# EAGLE design Adafruit Feather M0 Adalogger (EAGLE 9.6.2)
COMPANY: ADAFRUIT INDUSTRIES; DRAWN: KTOWN; REV: B
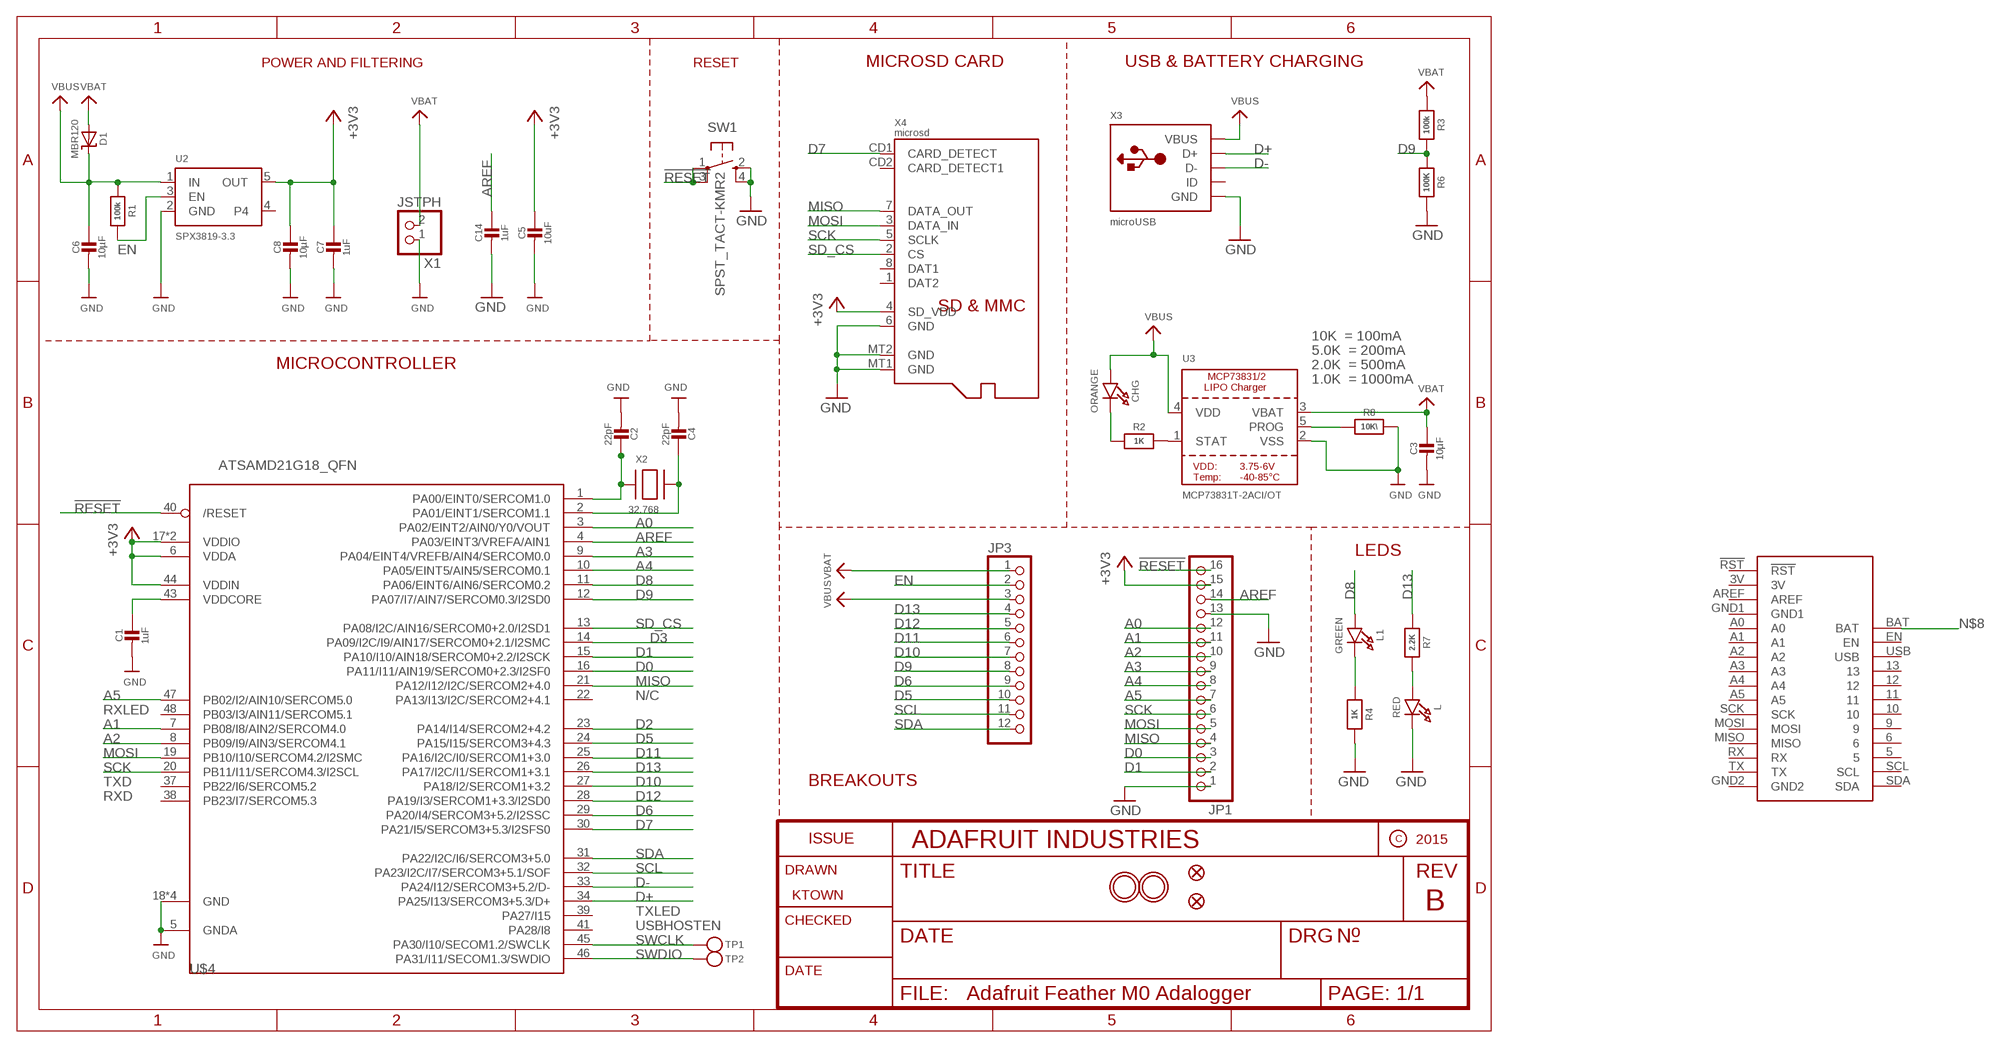
[diagram p0: schematic, sheet 1]

## Parts
C1  1uF  CAP_CERAMIC0603_NO  [0603-NO]
C2  22pF  CAP_CERAMIC0603_NO  [0603-NO]
C3  10µF  CAP_CERAMIC0805-NOOUTLINE  [0805-NO]
C4  22pF  CAP_CERAMIC0603_NO  [0603-NO]
C5  10uF  CAP_CERAMIC0805-NOOUTLINE  [0805-NO]
C6  10µF  CAP_CERAMIC0805-NOOUTLINE  [0805-NO]
C7  1uF  CAP_CERAMIC0603_NO  [0603-NO]
C8  10µF  CAP_CERAMIC0805-NOOUTLINE  [0805-NO]
C14  1uF  CAP_CERAMIC0603_NO  [0603-NO]
CHG  ORANGE  LED0805_NOOUTLINE  [CHIPLED_0805_NOOUTLINE]
D1  MBR120  DIODE-SCHOTTKYSOD-123  [SOD-123]
JP1  HEADER-1X16ROUND  [1X16_ROUND]
JP3  HEADER-1X12  [1X12_ROUND]
L  RED  LED0805_NOOUTLINE  [CHIPLED_0805_NOOUTLINE]
L1  GREEN  LED0805_NOOUTLINE  [CHIPLED_0805_NOOUTLINE]
R1  100k  RESISTOR_0603_NOOUT  [0603-NO]
R2  1K  RESISTOR_0603_NOOUT  [0603-NO]
R3  100k  RESISTOR_0603_NOOUT  [0603-NO]
R4  1K  RESISTOR_0603_NOOUT  [0603-NO]
R6  100K  RESISTOR_0603_NOOUT  [0603-NO]
R7  2.2K  RESISTOR_0603_NOOUT  [0603-NO]
R8  10K\  RESISTOR_0603_NOOUT  [0603-NO]
SW1  SPST_TACT-KMR2  [KMR2]
TP1  TESTPOINTROUND1.5MM  [TESTPOINT_ROUND_1.5MM]
TP2  TESTPOINTROUND1.5MM  [TESTPOINT_ROUND_1.5MM]
U2  SPX3819-3.3  VREG_SOT23-5  [SOT23-5]
U3  MCP73831T-2ACI/OT  MCP73831/2  [SOT23-5]
U$4  ATSAMD21G18_QFN  ATSAMD21J_QFN  [TQFN48_7MM]
U$12  FEATHER_MO_ADALOGGER  [FEATHER_M0_ADALOGGER]
U$31  MOUNTINGHOLE2.5  [MOUNTINGHOLE_2.5_PLATED]
U$32  MOUNTINGHOLE2.5  [MOUNTINGHOLE_2.5_PLATED]
U$34  FIDUCIAL""  [FIDUCIAL_1MM]
U$35  FIDUCIAL""  [FIDUCIAL_1MM]
X1  JSTPH  CON_JST_PH_2PIN  [JSTPH2]
X2  32.768  XTAL-3.2X1.5  [XTAL3215]
X3  microUSB  USB_MICRO_20329_V2  [4UCONN_20329_V2]
X4  microsd  MICROSD  [MICROSD]

## Nets
!RESET: JP1.16 SW1.1(P) SW1.3(P1) U$4.40(/RESET)
+3V3: C5.1 C7.1 C8.1 JP1.15 U2.5(OUT) U$4.6(VDDA) U$4.17(VDDIO) U$4.36(VDDIO) U$4.44(VDDIN) X4.4(SD_VDD)
A0: JP1.12 U$4.3(PA02/EINT2/AIN0/Y0/VOUT)
A1: JP1.11 U$4.7(PB08/I8/AIN2/SERCOM4.0)
A2: JP1.10 U$4.8(PB09/I9/AIN3/SERCOM4.1)
A3: JP1.9 U$4.9(PA04/EINT4/VREFB/AIN4/SERCOM0.0)
A4: JP1.8 U$4.10(PA05/EINT5/AIN5/SERCOM0.1)
A5: JP1.7 U$4.47(PB02/I2/AIN10/SERCOM5.0)
AREF: C14.1 JP1.14 U$4.4(PA03/EINT3/VREFA/AIN1)
D0: JP1.3 U$4.16(PA11/I11/AIN19/SERCOM0+2.3/I2SF0)
D1: JP1.2 U$4.15(PA10/I10/AIN18/SERCOM0+2.2/I2SCK)
D2: U$4.23(PA14/I14/SERCOM2+4.2)
D3: U$4.14(PA09/I2C/I9/AIN17/SERCOM0+2.1/I2SMC)
D5: JP3.10 U$4.24(PA15/I15/SERCOM3+4.3)
D6: JP3.9 U$4.29(PA20/I4/SERCOM3+5.2/I2SSC)
D7: U$4.30(PA21/I5/SERCOM3+5.3/I2SFS0) X4.CD1(CARD_DETECT)
D8: L1.A U$4.11(PA06/EINT6/AIN6/SERCOM0.2)
D9: JP3.8 R3.2 R6.1 U$4.12(PA07/I7/AIN7/SERCOM0.3/I2SD0)
D10: JP3.7 U$4.27(PA18/I2/SERCOM1+3.2)
D11: JP3.6 U$4.25(PA16/I2C/I0/SERCOM1+3.0)
D12: JP3.5 U$4.28(PA19/I3/SERCOM1+3.3/I2SD0)
D13: JP3.4 R7.1 U$4.26(PA17/I2C/I1/SERCOM1+3.1)
D+: U$4.34(PA25/I13/SERCOM3+5.3/D+) X3.D+
D-: U$4.33(PA24/I12/SERCOM3+5.2/D-) X3.D-
EN: JP3.2 R1.2 U2.3(EN)
GND: C1.2 C2.2 C3.2 C4.2 C5.2 C6.2 C7.2 C8.2 C14.2 JP1.1 JP1.13 L.C R4.2 R6.2 R8.2 SW1.2(S) SW1.4(S1) U2.2(GND) U3.2(VSS) U$4.5(GNDA) U$4.18(GND) U$4.35(GND) U$4.42(GND) U$4.THERMAL(GND) X1.1 X3.BASE@1(GND) X3.BASE@2(GND) X3.GND X3.SPRT@1(GND) X3.SPRT@2(GND) X3.SPRT@3(GND) X3.SPRT@4(GND) X4.6(GND) X4.MT1(GND) X4.MT2(GND)
MISO: JP1.4 U$4.21(PA12/I12/I2C/SERCOM2+4.0) X4.7(DATA_OUT)
MOSI: JP1.5 U$4.19(PB10/I10/SERCOM4.2/I2SMC) X4.3(DATA_IN)
N$1: CHG.C R2.1
N$2: L.A R7.2
N$3: R2.2 U3.1(STAT)
N$4: R8.1 U3.5(PROG)
N$5: C2.1 U$4.1(PA00/EINT0/SERCOM1.0) X2.P$1
N$6: L1.C R4.1
N$7: C4.1 U$4.2(PA01/EINT1/SERCOM1.1) X2.P$2
N$8: U$12.BAT
SCK: JP1.6 U$4.20(PB11/I11/SERCOM4.3/I2SCL) X4.5(SCLK)
SCL: JP3.11 U$4.32(PA23/I2C/I7/SERCOM3+5.1/SOF)
SD_CS: U$4.13(PA08/I2C/AIN16/SERCOM0+2.0/I2SD1) X4.2(CS)
SDA: JP3.12 U$4.31(PA22/I2C/I6/SERCOM3+5.0)
SWCLK: TP1.P$1 U$4.45(PA30/I10/SECOM1.2/SWCLK)
SWDIO: TP2.P$1 U$4.46(PA31/I11/SECOM1.3/SWDIO)
VBAT: C3.1 D1.A JP3.1 R3.1 U3.3(VBAT) X1.2
VBUS: C6.1 CHG.A D1.C JP3.3 R1.1 U2.1(IN) U3.4(VDD) X3.VBUS
VDDCORE: C1.1 U$4.43(VDDCORE)
Unconnected: U2.4 U$4.22(PA13/I13/I2C/SERCOM2+4.1) U$4.37(PB22/I6/SERCOM5.2) U$4.38(PB23/I7/SERCOM5.3) U$4.39(PA27/I15) U$4.41(PA28/I8) U$4.48(PB03/I3/AIN11/SERCOM5.1) U$12.3V U$12.5 U$12.6 U$12.9 U$12.10 U$12.11 U$12.12 U$12.13 U$12.!RST U$12.A0 U$12.A1 U$12.A2 U$12.A3 U$12.A4 U$12.A5 U$12.AREF U$12.EN U$12.GND1 U$12.GND2 U$12.MISO U$12.MOSI U$12.RX U$12.SCK U$12.SCL U$12.SDA U$12.TX U$12.USB X3.ID X4.1(DAT2) X4.8(DAT1) X4.CD2(CARD_DETECT1)

## Notes on the sheet
- POWER AND FILTERING | RESET | MICROSD CARD | USB & BATTERY CHARGING
- 10K  = 100mA
- 5.0K  = 200mA
- MICROCONTROLLER | 2.0K  = 500mA
- 1.0K  = 1000mA
- LEDS
- N/C
- RXLED
- TXD | BREAKOUTS
- RXD
- TXLED
- USBHOSTEN

## Library data of the parts
C1-C8 C14 = microbuilder:CAP_CERAMIC: Ceramic Capacitors For new designs, use the packages preceded by an '_' character since they are more reliable: The following footprints should be used on most boards: _0402 - Standard footprint for regular board layouts _0603 - Standard footprint for regular board layouts _0805 - Standard footprint for regular board layouts _1206 - Standard footprint for regular board layouts For extremely tight-pitch boards where space is at a premium, the following 'micro-pitch' footprints can be used (smaller pads, no silkscreen outline, etc.): _0402MP - Micro-pitch footprint for very dense/compact boards _0603MP - Micro-pitch footprint for very dense/compact boards _0805MP - Micro-pitch footprint for very dense/compact boards _1206MP - Micro-pitch footprint for very dense/compact boards
CHG L L1 = microbuilder:LED: LED 0603 - 0603 Surface Mount Package 2mA: Green LED - Low Power (3.9mcd, 2ma, 1.7Vf) - Digikey: 475-2709-2-ND Orange LED - Low Power (9.8mcd, 2ma, 1.8Vf) - Digikey: 475-1194-2-ND Red LED - Low Power (5mcd, 2ma, 1.8Vf) - Digikey: 475-1195-2-ND Yellow LED - Low Power (7mcd, 2ma, 1.8Vf) - Digikey: 475-1196-2-ND 5mA: Blue LED - Low Power (17mcd, 5ma, 2.9Vf) - Digikey: LNJ937W8CRACT-ND 0805 - 0805 Surface Mount Package 2mA: Red LED (8.8mcd, 2mA, 1.8Vf, Clear) - Low Power [Digikey: 475-2510-1-ND] Green LED (5mcd, 2mA, 1.8Vf, Clear) - Low Power [Digikey: 475-2730-1-ND] Yellow LED (11.3mcd, 2mA, 1.8Vf, Clear) - Low Power [Digikey: 475-2555-1-ND] 20mA: Red LED (104mcd, 20mA, Diffused) - LS R976 [Digikey: 475-1278-6-ND] Red LED (12mcd, 20mA, 2.0Vf, Clear) - APT2012EC [Digikey: 754-1128-1-ND] Green LED (15mcd, 20mA, 2.2Vf, Clear) - APT2012GC [Digikey: 754-1131-1-ND] Orange LED (160mcd, 20mA, 2.1Vf, Clear) - APT2012SECK [Digikey: 754-1130-1-ND] 1206 - 1206 Surface Mount Package Green LED (26mcd, 20mA, Diffused) - LG N971 [Digikey: 475-1407-6-ND] Red LED (15mcd, 20mA, Diffused) - LH N974 [Digikey: 475-1416-6-ND] Cree - Cree High-Power Surface Mount LEDs XPEBWT-L1-0000-00D50 - White 111lm 350mA 2.9Vf 6200K 110° XTEAWT-00-0000-00000LEE3 - White 114lm 350mA 2.85Vf 5000K 115° Everlight - Everlight 45-21 Series Surface Mount LEDs 45-21/QK2C-B2832AC2CB2/2T - Warm White 2000mcd 20mA 3.25Vf 3050K 120° 45-21/LK2C-B38452C4CB2/2T - Nuetral White 2000mcd 20mA 3.25Vf 4150K 120° 45-21/LK2C-B50634C6CB2/2T - Cold White 2200mcd 20mA 3.25Vf 5650K 120° PLCC2 Reverse Mount LS T77K-J1L2-1-0-2-R18-Z - Red 11.25mcd 2mA 1.8Vf 630nm 120° LO T77K-L1M2-24-Z - Orange 19.6mcd 2mA 1.8Vf 606nm 120° LY T77K-K2M1-26-Z - Yellow 15.7mcd 2mA 1.8Vf 587nm 120°
D1 = microbuilder:DIODE-SCHOTTKY
JP1 = microbuilder:HEADER-1X16: PIN HEADER
JP3 = microbuilder:HEADER-1X12
R1-R4 R6-R8 = microbuilder:RESISTOR: Resistors For new designs, use the packages preceded by an '_' character since they are more reliable: The following footprints should be used on most boards: _0402 - Standard footprint for regular board layouts _0603 - Standard footprint for regular board layouts _0805 - Standard footprint for regular board layouts _1206 - Standard footprint for regular board layouts For extremely tight-pitch boards where space is at a premium, the following 'micro-pitch' footprints can be used (smaller pads, no silkscreen outline, etc.): _0402MP - Micro-pitch footprint for very dense/compact boards _0603MP - Micro-pitch footprint for very dense/compact boards _0805MP - Micro-pitch footprint for very dense/compact boards _1206MP - Micro-pitch footprint for very dense/compact boards
SW1 = adafruit:SPST_TACT: SMT 6mm switch, EVQQ2 series http://www.ladyada.net/library/eagle
TP1 TP2 = microbuilder:TESTPOINT: Test Point Various test points for characterisation and PCB testing TESTPOINT_SMT - Compact Surface Mount Test Point [Digikey: 5016KTR-ND]
U2 = microbuilder:VREG_SOT23-5: SOT23-5 Fixed Voltage Regulators Part Current Out V Out V In V Dropout θJA (°C/W) TJ (°C) Digikey Part No. ADP121 150mA 3.3V 3.4-5.5V 0.09V @ 150mA -- -- ADP121-AUJZ33R7CT-ND ADP121 150mA 3.0V 3.1-5.5V 0.09V @ 150mA -- -- ADP121-AUJZ30R7CT-ND ADP122 300mA 3.3V 3.4-5.5V 0.085V @ 300mA -- -- ADP122AUJZ-3.3-R7CT-ND ADP1712 300mA 3.3V 3.5-5.5V 0.17V @ 300mA -- -- ADP1712AUJZ-3.3-R7TR-ND AP7311 (Low Cost) 150mA 3.3V 3.5-6V 0.15V @ 150mA -- -- AP7311-33WG-7DICT-ND LD39015M18R 150mA 1.8V 1.9V-5.5V 0.08V @ 100mA -- -- 497-6977-1-ND LP2985A-33DBVR 150mA 3.3V 3.3-16V 0.28V @ 150mA 206 150 296-18479-1-ND MCP1824T-3302E/OT 300mA 3.3V 3.5V-6V 0.2V @ 300mA -- -- MCP1824T-3302E/OTCT-ND MIC5205-2.5YM5 TR 150mA 2.5V 2.7-16V 0.165V @ 150mA -- -- 576-1257-2-ND MIC5205-3.0YM5 TR 150mA 3.0V 3.2V-16V 0.165V @ 150mA -- -- 576-1258-2-ND MIC5205-3.3YM5 TR 150mA 3.3V 3.5V-16V 0.165V @ 150mA -- -- 576-1259-2-ND TPS780330220 150mA 3.3V+2.2V 3.6-5.5V 250mV Max -- -- 296-23332-1-ND TDA3663/N1,135 100mA 3.3V 3.5-45V 0.18V @ 50mA -- -- 568-5343-1-ND Max operating temp can be calculated using θJA, TJ (max junction temperature), and power in watts. Set the "Maximum Ambient Temperature" until it reaches TJ ("Max Junction Temperature"), which is the absolute limit for safe use of the regulator: Heat Sink Temperature Calculator <http://www.daycounter.com/Calculators/Heat-Sink-Temperature-Calculator.phtml> For example, With 12V source into a 3.3V LP2985 and a 30mA load, we are dissipating (12V-3.3V) * 0.03A = 0.261W. With a θJA of 206 °C/W, a TJ of 150°C, and 261mW we can safely use the chip without a heat sink up to 75°C (=147.1°C Junction Temperature).
U3 = microbuilder:MCP73831/2: MCP73831/2 LIPO Charger VDD: 3.75 - 6V Temp -40 - 85°C Programmable Charge Rate: 15-500mA NOTE: STAT is a tri-state logic output on the MCP73831 and an open-drain output on the MCP73832. SOT23-5 with 4.2V output and tri-state logic on STAT = MCP73831T-2ACI/OT
U$4 = microbuilder:ATSAMD21J
U$12 = GNSS-proto:FEATHER_MO_ADALOGGER
U$31 U$32 = microbuilder:MOUNTINGHOLE: Mounting Hole For #2 screws (0.086"/2.18mm width, 0.094"/2.4mm hole) use 2.5mm; BOM: EXCLUDE
U$34 U$35 = microbuilder:FIDUCIAL: Fiducial Alignment Points Various fiducial points for machine vision alignment.; BOM: EXCLUDE
X1 = microbuilder:CON_JST_PH_2PIN: JST 2-Pin Right-Angle Connector PH-Series - 4UConnector: 17311 SH-Series - 4UConnector: 07278
X2 = adafruit2:XTAL: Low cost SMT crystals, no capacitors included http://www.ladyada.net/library/eagle
X3 = microbuilder:USB: USB Connectors USBMINIB - Surface Mount Female Mini-B USB Connector 4UConnector: 06564
X4 = microbuilder:MICROSD: MicroSD/Transflash Card Holder with SPI pinout 3M: 2908-05WB-MG 4UConnector: 19656 Footprint courtesy: Adafruit Industries

## Board
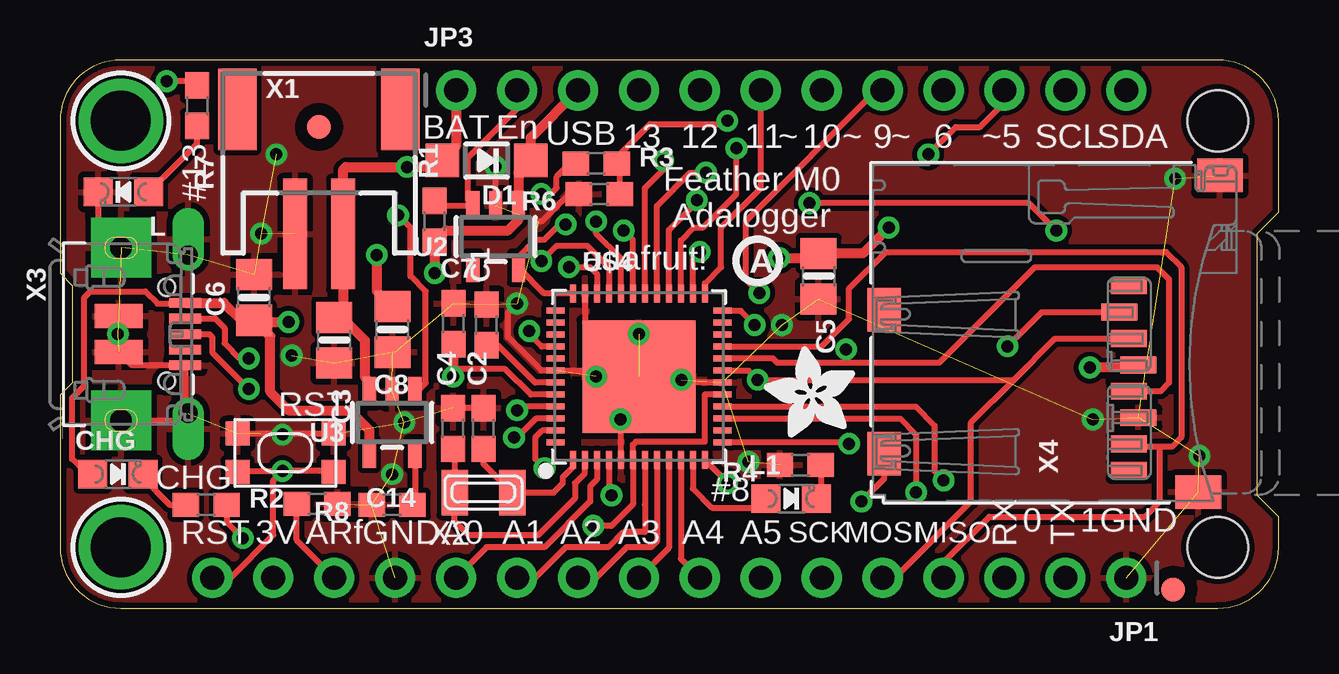
[diagram p1: board, top side]
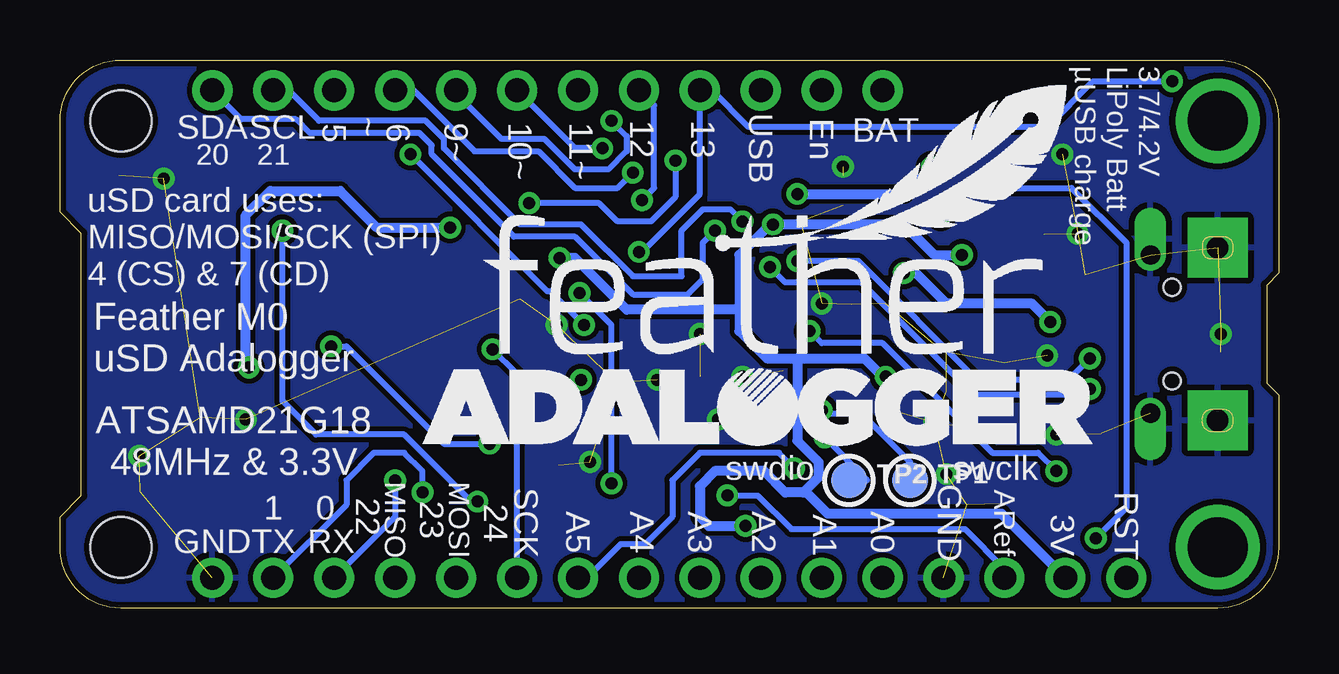
[diagram p2: board, bottom side, seen from below]

Size 50.8 x 22.86 mm. Coordinates in mm from the lower left corner, seen from the top.
Outline: 2.54,0 48.26,0 arc90 50.8,2.54 50.8,3.81 49.91,4.7 49.91,15.62 50.8,16.51 50.8,20.32 arc90 48.26,22.86 2.54,22.86 arc90 0,20.32 0,13.97 0.51,13.46 0.51,9.4 0,8.89 0,2.54 arc90 2.54,0
Copper layers (1*16): Top 0.035mm / dielectric 1.5mm / Bottom 0.035mm
Design rules "adafruit *": minimum track width 8mil, minimum drill 15.5mil, track to track 8mil, track to pad 8mil, pad to pad 8mil, via to via 8mil, smd to smd 8mil, copper to edge 10mil, drill to drill 8mil, minimum pad ring 10mil, minimum via ring 8mil, stop-mask expansion 2mil, vias tented up to drill 20mil, thermal gap 10mil
Holes 2.54 mm at 48.26,20.32 48.26,2.54
tRestrict: area 21.3,6.9 to 21.7,9.7; area 22.1,12.1 to 27.1,12.4; area 26.5,9.7 to 27.1,12.2

### Footprints (pad centres in the part's own frame; a part is rotated, then mirrored left to right if it is on the bottom)
0603-NO = smd 1.1 x 1: 1 -0.85,0; 2 0.85,0
0805-NO = smd 1.3 x 1.5: 1 -0.95,0; 2 0.95,0
CHIPLED_0805_NOOUTLINE = smd 1.2 x 1.2: A 0,-1.05; C 0,1.05
SOD-123 = smd 1.4 x 1.4: A 1.85,0; C -1.85,0
1X16_ROUND = drill 1 pad 1.676: 1 -19.05,0; 2 -16.51,0; 3 -13.97,0; 4 -11.43,0; 5 -8.89,0; 6 -6.35,0; 7 -3.81,0; 8 -1.27,0; 9 1.27,0; 10 3.81,0; 11 6.35,0; 12 8.89,0; 13 11.43,0; 14 13.97,0; 15 16.51,0; 16 19.05,0
1X12_ROUND = drill 1 pad 1.676: 1 -13.97,0; 2 -11.43,0; 3 -8.89,0; 4 -6.35,0; 5 -3.81,0; 6 -1.27,0; 7 1.27,0; 8 3.81,0; 9 6.35,0; 10 8.89,0; 11 11.43,0; 12 13.97,0
KMR2 = smd 1 x 1: 1 2,0.8; 2 2,-0.8; 3 -2,0.8; 4 -2,-0.8
TESTPOINT_ROUND_1.5MM = smd 1.5 x 1.5: P$1 0,0
SOT23-5 = smd 0.55 x 1.2: 1 -0.95,-1.3; 2 0,-1.3; 3 0.95,-1.3; 4 0.95,1.3; 5 -0.95,1.3
TQFN48_7MM = smd 0.25 x 0.75: 1 -2.75,-3.475; 2 -2.25,-3.475; 3 -1.75,-3.475; 4 -1.25,-3.475; 5 -0.75,-3.475; 6 -0.25,-3.475; 7 0.25,-3.475; 8 0.75,-3.475; 9 1.25,-3.475; 10 1.75,-3.475; 11 2.25,-3.475; 12 2.75,-3.475; 25 2.75,3.475; 26 2.25,3.475; 27 1.75,3.475; 28 1.25,3.475; 29 0.75,3.475; 30 0.25,3.475; 31 -0.25,3.475; 32 -0.75,3.475; 33 -1.25,3.475; 34 -1.75,3.475; 35 -2.25,3.475; 36 -2.75,3.475 | smd 0.75 x 0.25: 13 3.475,-2.75; 14 3.475,-2.25; 15 3.475,-1.75; 16 3.475,-1.25; 17 3.475,-0.75; 18 3.475,-0.25; 19 3.475,0.25; 20 3.475,0.75; 21 3.475,1.25; 22 3.475,1.75; 23 3.475,2.25; 24 3.475,2.75; 37 -3.475,2.75; 38 -3.475,2.25; 39 -3.475,1.75; 40 -3.475,1.25; 41 -3.475,0.75; 42 -3.475,0.25; 43 -3.475,-0.25; 44 -3.475,-0.75; 45 -3.475,-1.25; 46 -3.475,-1.75; 47 -3.475,-2.25; 48 -3.475,-2.75 | smd 4.7 x 4.7: THERMAL 0,0
FEATHER_M0_ADALOGGER = drill 1 pad 1.676: 3V 8.89,1.27; 5 39.37,21.59; 6 36.83,21.59; 9 34.29,21.59; 10 31.75,21.59; 11 29.21,21.59; 12 26.67,21.59; 13 24.13,21.59; !RST 6.35,1.27; A0 16.51,1.27; A1 19.05,1.27; A2 21.59,1.27; A3 24.13,1.27; A4 26.67,1.27; A5 29.21,1.27; AREF 11.43,1.27; BAT 16.51,21.59; EN 19.05,21.59; GND1 13.97,1.27; GND2 44.45,1.27; MISO 36.83,1.27; MOSI 34.29,1.27; RX 39.37,1.27; SCK 31.75,1.27; SCL 41.91,21.59; SDA 44.45,21.59; TX 41.91,1.27; USB 21.59,21.59 | hole 2.54: 48.26,20.32; 48.26,2.54; 2.54,20.32; 2.54,2.54
MOUNTINGHOLE_2.5_PLATED = drill 2.5 pad 3.2: P$1 0,0
FIDUCIAL_1MM = smd 1 x 1: 1 0,0
JSTPH2 = smd 1 x 4.6: 1 -1,-3.7; 2 1,-3.7 | smd 1.6 x 3.4: NC1 -3.4,1.5; NC2 3.4,1.5
XTAL3215 = smd 1.1 x 1.9: P$1 1.2,0; P$2 -1.2,0
4UCONN_20329_V2 = smd 1 x 2: BASE@1 -0.75,-2; BASE@2 0.75,-2 | smd 0.4 x 1.35: D+ 0,0.775; D- -0.65,0.775; GND 1.3,0.775; ID 0.65,0.775; VBUS -1.3,0.775 | drill 0.8 pad 1.2 offset: SPRT@1 -3.3,0.9; SPRT@2 3.3,0.9 | drill 0.9 pad 2.5 square: SPRT@3 -3.6,-1.9; SPRT@4 3.6,-1.9 | hole 0.7: -1.95,0; 1.95,0
MICROSD = smd 0.7 x 1.5: 1 9,-10.64; 2 7.9,-10.24; 3 6.8,-10.64; 4 5.7,-11.04; 5 4.6,-10.64; 6 3.5,-11.04; 7 2.4,-10.64; 8 1.3,-10.64 | smd 1.8 x 1.4: CD1 2,-0.44; CD2 8,-0.44 | smd 1.4 x 1.9: MT1 0.4,-13.54; MT2 13.6,-14.44

### Placement (x,y rotation side)
C1  17.78,11.81 90 top
C2  17.65,7.49 90 top
C3  11.43,11.18 270 top
C4  16.38,7.49 90 top
C5  31.62,13.84 270 top
C6  8.09,12.96 90 top
C7  16.4,11.86 90 top
C8  13.86,11.62 270 top
C14  10.72,4.34 0 top
CHG  2.41,5.59 270 top
D1  17.78,18.67 180 top
JP1  25.4,1.27 180 top
JP3  30.48,21.59 0 top
L  2.65,17.36 90 top
L1  30.48,4.57 270 top
R1  15.62,16.13 90 top
R2  6.1,4.32 0 top
R3  22.35,18.54 0 top
R4  30.86,5.97 180 top
R6  22.48,17.27 180 top
R7  5.71,20.95 270 top
R8  13.84,4.32 180 top
SW1  9.4,6.48 180 top
TP1  15.37,5.33 0 bottom
TP2  17.91,5.33 0 bottom
U2  18.16,15.49 180 top
U3  13.84,7.75 180 top
U$4  24.13,9.65 0 top
U$7  [ADAFRUIT_3.5MM]  33.15,7.11 90 top
U$9  [PCBFEAT-REV-040]  29.08,14.48 0 top
U$12  -6.1,38.23 0 top  (outside the outline)
U$13  [FEATHERLOGO]  33.15,10.54 0 bottom
U$14  [ADALOGGER_LOGO]  35.69,6.73 0 bottom
U$31  2.54,20.32 270 top
U$32  2.54,2.54 270 top
U$34  10.79,20.07 270 top
U$35  46.4,0.77 270 top
X1  10.79,19.3 0 top
X2  17.65,4.83 0 top
X3  4.45,11.43 270 top
X4  33.91,4.45 90 top

### Tracks (layer width: path | path; a pad name or v marks a point on that pad's centre or on a via)
!RESET  (via drill 0.5)
  Top 0.254: 6.48,1.27 JP1.16 7.11,1.27 8.89,3.05 8.89,5.33 v9.27,5.71 | U$4.40 20.09,10.9 19.56,11.43 v19.56,11.56 | SW1.1 7.44,5.71 v9.27,5.71 | SW1.3 11.36,5.71 v9.27,5.71
  Bottom 0.254: v9.27,5.71 10.03,6.48 11.94,6.48 16.51,11.05 19.05,11.05 v19.56,11.56
+3V3  (via drill 0.5)
  Top 0.254: U$4.44 19.63,8.9 18.56,9.97 16.57,9.97 16.4,10.14 C7.1 | v22.23,3.43 22.99,3.43 23.88,4.32 U$4.6 23.88,6.81 24,6.93 26.87,6.93 26.87,8.9 U$4.17 | 16.4,10.04 C7.1 | U$4.36 20.18,13.13 U2.5 19.11,14.67 19.81,15.37 20.19,15.37 20.83,16 v21.08,16 | 16.38,10.49 16.4,10.5 C7.1
  Top 0.406: v29.97,14.61 31.5,14.61 31.62,14.73 C5.1 33.46,14.79 v34.54,15.88 | v13.21,14.73 13.21,13.22 C8.1 | 16.38,10.49 v16.38,9.65 | X4.4 44.84,10.03 v42.93,10.03
  Bottom 0.254: 21.21,16 v21.08,16
  Bottom 0.406: v22.23,3.43 23.75,3.43 24.13,3.81 24.13,5.08 23.5,5.71 21.46,5.71 20.57,4.83 19.81,4.83 19.68,4.95 | 21.21,16 22.48,14.73 22.48,12.57 | 22.48,12.57 22.48,11.56 21.34,10.41 20.07,10.41 | 20.07,10.41 17.27,10.41 16.38,9.53 v16.38,9.65 | v13.21,14.73 14.35,14.73 15.62,16 v21.08,16 | 22.48,12.57 22.61,12.45 27.18,12.45 29.34,14.61 v29.97,14.61 | 20.07,10.41 20.07,6.99 19.18,6.1 19.18,5.46 19.68,4.95 | JP1.15 11.56,3.94 18.8,3.94 19.68,4.83 19.68,4.95 | v42.93,10.03 43.05,10.16 43.05,16.38 42.04,17.4 39.12,17.4 37.59,15.88 v34.54,15.88
A0
  Top 0.254: U$4.3 22.38,5.36 22.1,5.08 22.1,4.45 20.19,2.54 17.78,2.54 JP1.12
A1
  Top 0.254: U$4.7 24.38,4.31 24.38,3.17 23.5,3.17 22.86,2.54 21.08,2.54 19.81,1.27 JP1.11
A2
  Top 0.254: U$4.8 24.88,2.78 24.64,2.54 23.62,2.54 22.35,1.27 JP1.10 21.84,1.27
A3
  Top 0.254: U$4.9 25.38,2.52 JP1.9
A4
  Top 0.254: U$4.10 25.88,2.06 JP1.8
A5  (via drill 0.5)
  Top 0.254: U$4.47 20.1,7.4 19.81,7.11 19.81,6.22 v20.19,5.84
  Bottom 0.254: v20.19,5.84 20.83,6.48 24.13,6.48 25.27,5.33 25.27,3.81 26.42,2.67 27.43,2.67 28.83,1.27 JP1.7
AREF  (via drill 0.5)
  Top 0.254: JP1.14 9.87,2.83 C14.1 | U$4.4 22.88,4.81 v22.99,4.7
  Bottom 0.254: 11.43,1.78 JP1.14 11.43,1.65 13.08,3.3 20.32,3.3 21.72,4.7 v22.99,4.7
D0  (via drill 0.5)
  Top 0.254: U$4.16 35.67,8.4 36.45,7.62 36.45,5.71 v36.83,5.33
  Bottom 0.254: v36.83,5.33 36.83,3.81 JP1.3
D1  (via drill 0.5)
  Top 0.254: U$4.15 35.02,7.9 35.69,7.24 v35.69,4.83
  Bottom 0.254: v35.69,4.83 35.69,5.71 36.45,6.48 37.72,6.48 38.86,5.33 38.86,4.32 JP1.2
D5  (via drill 0.5)
  Top 0.254: U$4.24 28.36,12.4 v28.96,11.81 | v36.2,18.92 37.34,20.07 38.35,20.07 39.37,21.08 JP3.10
  Bottom 0.254: v28.96,11.81 30.35,13.21 30.48,13.21 v36.2,18.92
D6  (via drill 0.5)
  Top 0.254: U$4.29 24.88,16.78 26.27,18.16 26.29,18.16 26.42,18.16 v26.92,18.16
  Bottom 0.254: JP3.9 36.07,21.59 33.53,19.05 30.86,19.05 29.34,17.53 27.56,17.53 v26.92,18.16
D7  (via drill 0.5)
  Top 0.254: U$4.30 24.38,17.52 25.15,18.29 v25.15,18.67 | X4.CD1 34.35,5.39 v33.4,4.45 | v41.53,15.75 40.39,16.89 v31.24,16.89
  Bottom 0.254: v25.15,18.67 25.15,17.14 26.16,16.13 27.56,16.13 28.32,16.89 v31.24,16.89 | v33.4,4.45 33.66,4.45 36.45,7.24 40.13,7.24 41.53,8.64 v41.53,15.75
D8
  Top 0.254: U$4.11 26.38,4.99 27.18,4.19 29.05,4.19 L1.A
D9  (via drill 0.5)
  Top 0.254: JP3.8 34.04,21.59 28.57,16.13 28.57,13.72 v29.15,13.14 | U$4.12 27.81,5.24 v27.81,5.21 | v27.81,20.32 27.69,20.19 24.6,20.19 23.2,18.8 R3.2 23.33,18.41 R6.1
  Bottom 0.254: v29.15,13.14 27.81,11.81 v27.81,5.21 | v27.81,20.32 27.18,19.68 27.18,19.05 27.94,18.29 29.34,18.29 30.61,19.56 32.38,19.56 34.29,21.46 JP3.8
D10  (via drill 0.5)
  Top 0.254: U$4.27 25.88,15.34 26.42,15.88 26.8,15.88 28.19,17.27 v28.19,19.18
  Bottom 0.254: 31.62,21.46 JP3.7 29.34,19.18 v28.19,19.18
D11
  Top 0.254: U$4.25 26.88,13.54 27.56,14.22 27.56,15.88 29.21,17.53 JP3.6
D12  (via drill 0.5)
  Top 0.254: U$4.28 25.38,15.77 26.54,16.93 v26.54,17.02
  Bottom 0.254: v26.54,17.02 26.04,17.53 26.04,20.95 JP3.5
D13  (via drill 0.5)
  Top 0.254: U$4.26 26.38,14.57 v26.67,14.86 | R7.1 5.55,21.97 v4.45,21.97
  Bottom 0.254: v4.45,21.97 7.75,21.97 9.65,20.07 22.1,20.07 23.62,21.59 JP3.4 24.13,17.27 26.67,14.73 v26.67,14.86
D+  (via drill 0.5)
  Top 0.254: X3.D+ 6.22,11.43 6.35,11.3 6.35,10.67 v7.87,9.14 | v21.21,14.22 22.1,14.22 22.38,13.94 U$4.34
  Bottom 0.254: v7.87,9.14 8.13,8.89 12.7,8.89 17.4,13.59 20.57,13.59 v21.21,14.22
D-  (via drill 0.5)
  Top 0.254: X3.D- 6.46,12.08 6.86,11.68 6.86,11.05 7.49,10.41 v7.87,10.41 | v20.07,14.48 20.7,15.11 21.97,15.11 22.88,14.2 U$4.33
  Bottom 0.254: v7.87,10.41 8.76,9.53 12.57,9.53 17.53,14.48 v20.07,14.48
EN
  Top 0.254: JP3.2 19.05,20.83 17.02,18.8 17.02,16.99 U2.3 15.81,16.79 R1.2
GND  (via drill 0.5)  (40 unrouted)
  Top 0.254: L.C 1.59,15.03 X3.SPRT@3 | X3.BASE@2 3,10.13 X3.GND 5.22,8.26 X3.SPRT@2 5.04,7.83 X3.SPRT@4 | SW1.2 SW1.4 11.52,7.28 | 13.97,10.67 C8.2 | U$4.35 21.88,11.9 U$4.THERMAL | U$4.THERMAL 23.88,9.9 U$4.42 20.07,9.9 18.67,11.3 18.67,12.32 v19.05,12.7 | U$4.5 23.38,8.9 | 23.38,8.9 U$4.THERMAL | U$4.18 24.38,9.4 U$4.THERMAL | C2.2 C4.2 | U2.2 18.16,18.03 | 19.94,16.13 20.07,16.13 21.34,17.4 21.46,17.27 R6.2 | 23.38,8.9 23.37,8.89 v23.37,7.87
  Bottom 0.254: v28.7,6.1 28.57,5.97
  other vias: 2.41,11.43 9.65,10.54 9.02,18.92 13.84,5.59 9.27,7.24 18.16,18.41 22.35,9.65 24.13,11.43 25.91,9.53 14.35,7.75 8.38,15.62 43.05,7.87 47.5,6.35 46.48,17.91 30.1,11.81
  pour Top: 0,22.86 0,0 50.93,-0.13 50.93,22.73
  pour Bottom: 50.93,0 0,0 0,22.86 50.93,22.86
MISO
  Top 0.254: U$4.21 31.73,10.9 32.89,12.06 32.89,13.34 34.42,14.86 46.1,14.86 46.74,14.22 46.74,7.11 46.35,6.73 45.85,6.73 | JP1.4 36.83,1.91 38.73,3.81 45.21,3.81 45.85,4.45 45.85,6.73 | 45.85,6.73 44.66,6.73 X4.7
MOSI  (via drill 0.5)
  Top 0.254: U$4.19 28.71,9.9 v29.08,9.53 39.75,9.53 | JP1.5 34.8,1.27 37.97,4.45 37.97,7.75 39.75,9.53 | 39.75,9.53 41.47,11.24 X4.3
N$1
  Top 0.254: CHG.C 3.46,5.43 4.57,4.32 R2.1
N$2
  Top 0.254: L.A 5.71,19.38 R7.2
N$3  (via drill 0.5)
  Top 0.254: U3.1 14.89,9.05 15.24,9.4 15.24,13.21 14.61,13.84 14.61,15.88 v14.1,16.38 | R2.2 6.95,3.6 v7.62,2.92
  Bottom 0.254: v7.62,2.92 6.35,4.19 6.35,15.24 8.64,17.53 13.08,17.53 14.1,16.51 v14.1,16.38
N$4
  Top 0.254: U3.5 14.79,4.42 R8.1
N$5
  Top 0.254: U$4.1 21.38,5.89 20.95,5.46 20.95,5.21 20.57,4.83 X2.P$1 17.65,6.03 C2.1
N$6
  Top 0.254: R4.1 31.71,4.75 L1.C
N$7
  Top 0.254: U$4.2 21.88,5.62 21.46,5.21 21.46,4.57 19.94,3.05 17.02,3.05 16.45,3.61 X2.P$2 16.45,6.57 C4.1
SCK  (via drill 0.5)
  Top 0.254: U$4.20 27.62,10.41 29.72,10.41 29.9,10.24 32.89,10.24 | 32.89,10.24 36.65,10.24 40.64,14.22 45.72,14.22 46.23,13.72 46.23,9.4 45.88,9.04 X4.5 | v32.77,10.79 32.77,10.36 32.89,10.24
  Bottom 0.254: JP1.6 31.75,9.78 v32.77,10.79
SCL  (via drill 0.5)
  Top 0.254: U$4.32 23.38,14.59 22.35,15.62 v22.35,16.13 22.35,16
  Bottom 0.254: JP3.11 41.27,21.59 40.01,20.32 35.56,20.32 34.8,19.56 34.8,19.18 31.62,16 29.08,16 26.92,13.84 24.89,13.84 24.89,15.75 24,16.64 22.86,16.64 v22.35,16.13
SD_CS  (via drill 0.5)
  Top 0.254: v39.5,10.92 40.92,12.35 X4.2 | v32.89,6.86 32.85,6.9 U$4.13
  Bottom 0.254: v39.5,10.92 38.86,10.92 34.8,6.86 v32.89,6.86
SDA  (via drill 0.5)
  Top 0.254: U$4.31 23.88,15.36 v23.5,15.75
  Bottom 0.254: JP3.12 43.24,20.38 40.96,20.38 40.39,19.81 35.81,19.81 35.31,19.3 35.31,18.92 31.88,15.49 29.34,15.49 26.92,13.08 24.64,13.08 24,13.72 24,15.24 v23.5,15.75
SWCLK  (via drill 0.5)
  Top 0.254: U$4.45 19.2,8.4 v19.05,8.26
  Bottom 0.254: v19.05,8.26 18.92,8.13 17.4,8.13 15.37,6.1 TP1.P$1
SWDIO  (via drill 0.5)
  Top 0.254: U$4.46 19.84,7.9 19.05,7.11 v18.92,7.11
  Bottom 0.254: 19.05,7.11 v18.92,7.11 17.14,5.33 TP2.P$1
VBAT  (via drill 0.5)
  Top 0.254: X1.2 11.81,15.62 | 11.79,12.49 C3.1 | v20.07,17.27 20.45,17.27 20.7,17.53 20.7,18 21.25,18.54 R3.1
  Top 0.406: 11.81,15.62 11.81,18.29 11.92,18.4 v14.46,18.4 15.66,18.4 D1.A 16.51,19.25 JP3.1 | X1.2 11.79,12.49 | C3.1 11.75,12.13 12.7,11.18 12.7,9.65 12.89,9.46 U3.3
  Bottom 0.406: v20.07,17.27 15.59,17.27 v14.46,18.4
VBUS  (via drill 0.5)
  Top 0.254: CHG.A 1.14,5.59 0.51,6.22 0.51,8.76 1.02,9.27 1.02,12.95 1.27,13.21 3.56,13.21 4.06,12.7 5.19,12.7 X3.VBUS | 7.55,12.01 C6.1 8.16,11.94
  Top 0.406: X3.VBUS 6.83,12.73 7.55,12.01 | JP3.3 19.63,19.63 D1.C 19.11,18.15 U2.1 19.11,16.19 18.67,15.75 16.09,15.75 R1.1 v15.62,13.97 | U3.4 12.89,7.43 12.06,8.26 9.53,8.26 8.76,9.02 8.76,11.33 C6.1 | 8.16,11.94 v9.53,11.94
  Bottom 0.406: v9.53,11.94 10.29,12.7 13.84,12.7 15.11,13.97 v15.62,13.97
VDDCORE
  Top 0.254: U$4.43 19.81,9.4 18.25,10.96 C1.1

### Text on the board
tPlace: BAT | En | USB | 13 | 12 | 11 | ~ | 10 | ~ | 9 | ~ | 6 | ~5 | SCL | SDA | #13 | Feather M0 / Adalogger | adafruit! | RST | CHG | #8 | RX | 0 | TX | 1 | GND | RST | 3V | ARf | GND | A0 | A1 | A2 | A3 | A4 | A5 | SCK | MOSI | MISO
bPlace: 3.7/4.2V / LiPoly Batt / µUSB charge | BAT | En | 13 | 12 | 6 | ~ | 5 | SCL | SDA | USB | 11~ | 10~ | 9~ | 21 | 20 | uSD card uses: / MISO/MOSI/SCK (SPI) / 4 (CS) & 7 (CD) | Feather M0 / uSD Adalogger | ATSAMD21G18 / 48MHz & 3.3V | swclk | swdio | ARef | GND | SCK | 24 | MOSI | 23 | MISO | 22 | 0 | 1 | RST | 3V | A0 | A1 | A2 | A3 | A4 | A5 | RX | TX | GND